# Altium schematic sheet TOP_SHEET.SchDoc: Pin Swapping
size 431 x 279 mm; DocumentNumber: 1; SheetNumber: 1; SheetTotal: 5
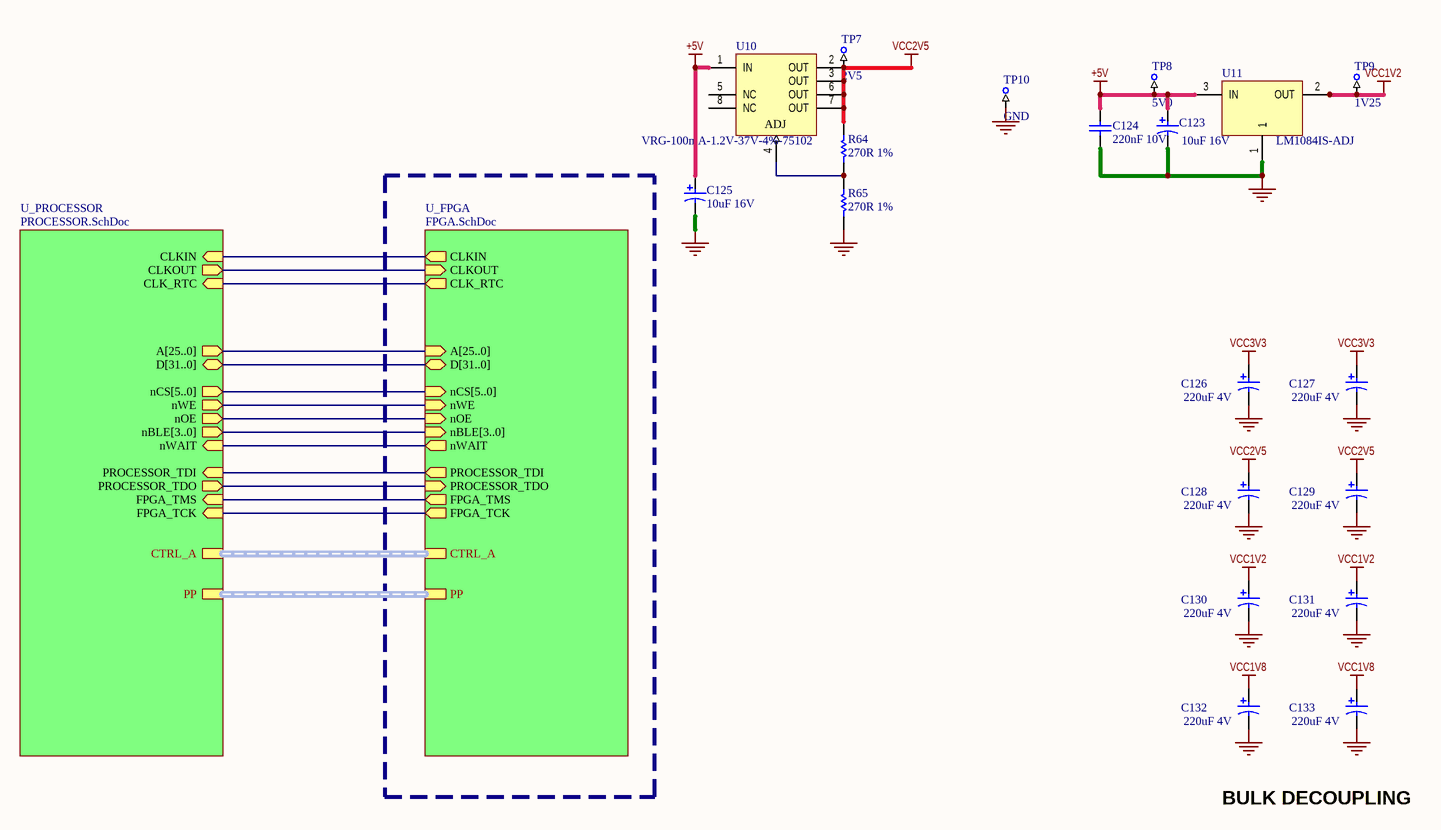
[diagram p0: TOP_SHEET.SchDoc]

## Parts
C123  10uF 16V  [CAPC3528]
C124  220nF 10V  [CAPC1608]
C125  10uF 16V  [CAPC3528]
C126  220uF 4V  [CAPC7343]
C127  220uF 4V  [CAPC7343]
C128  220uF 4V  [CAPC7343]
C129  220uF 4V  [CAPC7343]
C130  220uF 4V  [CAPC7343]
C131  220uF 4V  [CAPC7343]
C132  220uF 4V  [CAPC7343]
C133  220uF 4V  [CAPC7343]
R64  270R 1%  [RESC2012]
R65  270R 1%  [RESC2012]
TP7  2V5  [TestPin]  (no BOM)
TP8  5V0  [TestPin]  (no BOM)
TP9  1V25  [TestPin]  (no BOM)
TP10  GND  [TestPin]  (no BOM)
U10  VRG-100mA-1.2V-37V-4%-75102  [SOP127P600-8]
U11  LM1084IS-ADJ  [TO254P1435-4]

## Sub-sheets
U_FPGA = FPGA.SchDoc: FPGA_TMS (out), FPGA_TCK (out), PROCESSOR_TDO (in), PROCESSOR_TDI (out), CLKIN (out), A[25..0] (in), D[31..0] (bidir), nBLE[3..0] (in), nWE (in), nOE (in), nCS[5..0] (in), nWAIT (out), CLKOUT (in), CLK_RTC (out), PP (harness PP_13_LINES), CTRL_A (harness P_C_HARNESS)
U_PROCESSOR = PROCESSOR.SchDoc: A[25..0] (out), D[31..0] (bidir), CLKOUT (out), PROCESSOR_TDO (out), PROCESSOR_TDI (in), nBLE[3..0] (out), nWE (out), nOE (out), nCS[5..0] (out), nWAIT (in), CLKIN (in), FPGA_TMS (in), FPGA_TCK (in), CLK_RTC (in), PP (harness PP_13_LINES), CTRL_A (harness P_C_HARNESS)

## Nets
+5V: C123.1 C124.1 C125.1 TP8.1 U10.1(IN) U11.3(IN)
GND: C123.2 C124.2 C125.2 C126.2 C127.2 C128.2 C129.2 C130.2 C131.2 C132.2 C133.2 R65.2 TP10.1 U11.1
VCC1V2: C130.1 C131.1 TP9.1 U11.2(OUT) U11.4(HeatSink)
VCC1V8: C132.1 C133.1
VCC2V5: C128.1 C129.1 R64.1 TP7.1 U10.2(OUT) U10.3(OUT) U10.6(OUT) U10.7(OUT)
VCC3V3: C126.1 C127.1
NetR64_2: R64.2 R65.1 U10.4(ADJ)
(unnamed): sheet U_PROCESSOR/CLKOUT, sheet U_FPGA/CLKOUT
(unnamed): sheet U_PROCESSOR/PROCESSOR_TDO, sheet U_FPGA/PROCESSOR_TDO
(unnamed): sheet U_PROCESSOR/PROCESSOR_TDI, sheet U_FPGA/PROCESSOR_TDI
(unnamed): sheet U_PROCESSOR/nWE, sheet U_FPGA/nWE
(unnamed): sheet U_PROCESSOR/nOE, sheet U_FPGA/nOE
(unnamed): sheet U_PROCESSOR/nWAIT, sheet U_FPGA/nWAIT
(unnamed): sheet U_PROCESSOR/CLKIN, sheet U_FPGA/CLKIN
(unnamed): sheet U_PROCESSOR/FPGA_TMS, sheet U_FPGA/FPGA_TMS
(unnamed): sheet U_PROCESSOR/FPGA_TCK, sheet U_FPGA/FPGA_TCK
(unnamed): sheet U_PROCESSOR/CLK_RTC, sheet U_FPGA/CLK_RTC

Not connected (* = marked no-connect by the designer): U10 5(NC) 8(NC)

## Buses and harness runs
bus sheet U_FPGA/A[25..0] = sheet U_PROCESSOR/A[25..0]
bus sheet U_FPGA/D[31..0] = sheet U_PROCESSOR/D[31..0]
bus sheet U_FPGA/nBLE[3..0] = sheet U_PROCESSOR/nBLE[3..0]
bus sheet U_FPGA/nCS[5..0] = sheet U_PROCESSOR/nCS[5..0]
harness sheet U_FPGA/CTRL_A = sheet U_PROCESSOR/CTRL_A
harness sheet U_FPGA/PP = sheet U_PROCESSOR/PP

## Notes on the sheet
- BULK DECOUPLING
- 8
- 7
- 6
- 5
- 4
- 3
- DWG. NO.
- REV.
- SHT.
- 2
- 1
- THIS DOCUMENT AND THE DATA DISCLOSED HEREIN OR HEREWITH IS THE PROPERTY OF ALTIUM LIMITED AND MAY BE FREELY DISTRIBUTED IN WHOLE. NO RIGHTS ARE RESERVED OR EXPRESS OR IMPLIED WARANTEE GIVEN.
- REVISION
- DESCRIPTION
- DATE
- APPROVED
- F
- E
- D
- C
- B
- ENG:
- APPROVALS
- PROJECT
- A
- DSN:
- CHK:
- REFERENCE DOCUMENTS
- PROJECT REVISION:
- TITLE
- DOCUMENT REVISION:
- DESIGN ITEM:
- BOM:
- FAB DWG:
- PCB DWG:
- ASSY DWG:
- SCALE:
- SIZE
- CAGE CODE
- FILE NAME
- DWG NO.
- SHEET
- OF
- REV

## Library data of the parts
C123 C125-C133 = CAP-P: Polar Capacitor
  C123 C125: Design Item Id: CAP-P-10uF-16V-MCCT-B
  C126-C133: Design Item Id: CAP-P-220uF-4V-MCCT-D
C124 = CAP-NP: Capacitor; Design Item Id: CAP-NP-220nF-10V-0603
R64 R65 = RES: Resistor; Design Item Id: RES-270R-1%-0805
TP7-TP10 = TestPin: Design Item Id: TestPin
U10 = VRG-ADJ-8: Low Current 3-Terminal Adjustable Positive Voltage Regulator; Design Item Id: VRG-100mA-1.2V-37V-4%-75102
U11 = VRG-ADJ-3: 5A Low Dropout Positive Regulators; Design Item Id: LM1084IS-ADJ